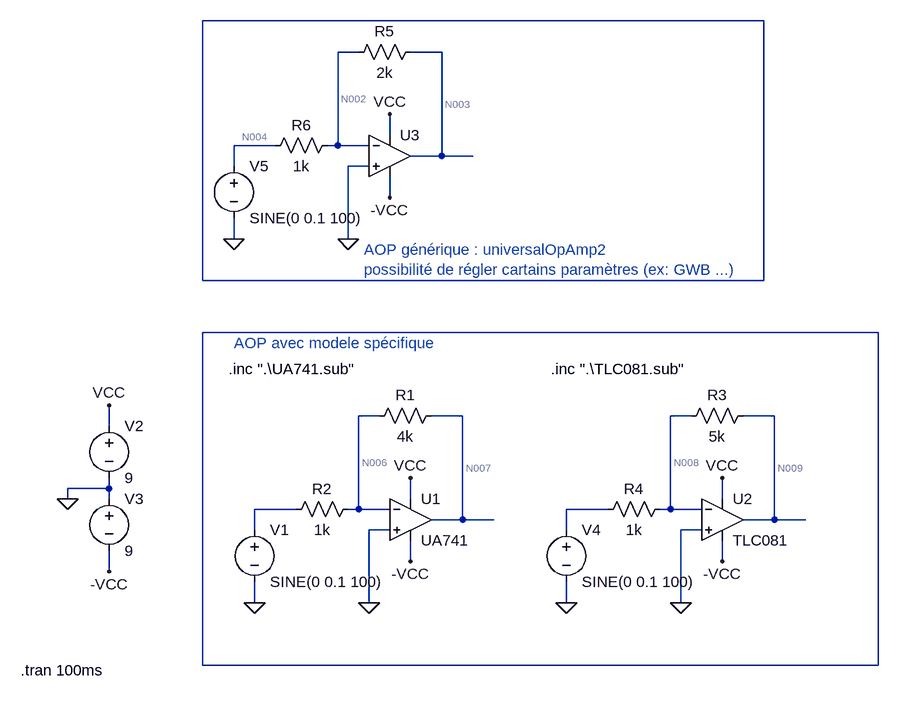
[diagram p0: schematic EssaiModeleAOP.asc]
EssaiModeleAOP.asc, the LTspice schematic file:
Version 4
SHEET 1 900 680
WIRE 720 -608 -144 -608
WIRE 96 -560 64 -560
WIRE 224 -560 176 -560
WIRE 144 -432 144 -464
WIRE -32 -416 -96 -416
WIRE 64 -416 64 -560
WIRE 64 -416 48 -416
WIRE 112 -416 64 -416
WIRE 224 -400 224 -560
WIRE 224 -400 176 -400
WIRE 272 -400 224 -400
WIRE -96 -384 -96 -416
WIRE 112 -384 80 -384
WIRE 144 -336 144 -368
WIRE -96 -272 -96 -304
WIRE 80 -272 80 -384
WIRE -144 -208 -144 -608
WIRE 720 -208 720 -608
WIRE 720 -208 -144 -208
WIRE 896 -128 -144 -128
WIRE 128 0 96 0
WIRE 256 0 208 0
WIRE 608 0 576 0
WIRE 736 0 688 0
WIRE -288 16 -288 -16
WIRE -288 112 -288 96
WIRE -288 112 -352 112
WIRE -352 128 -352 112
WIRE -288 128 -288 112
WIRE 176 128 176 96
WIRE 656 128 656 96
WIRE 0 144 -64 144
WIRE 96 144 96 0
WIRE 96 144 80 144
WIRE 144 144 96 144
WIRE 480 144 416 144
WIRE 576 144 576 0
WIRE 576 144 560 144
WIRE 624 144 576 144
WIRE 256 160 256 0
WIRE 256 160 208 160
WIRE 304 160 256 160
WIRE 736 160 736 0
WIRE 736 160 688 160
WIRE 784 160 736 160
WIRE -64 176 -64 144
WIRE 144 176 112 176
WIRE 416 176 416 144
WIRE 624 176 592 176
WIRE 176 224 176 192
WIRE 656 224 656 192
WIRE -288 240 -288 208
WIRE -64 288 -64 256
WIRE 112 288 112 176
WIRE 416 288 416 256
WIRE 592 288 592 176
WIRE -144 384 -144 -128
WIRE 896 384 896 -128
WIRE 896 384 -144 384
FLAG -64 288 0
FLAG -352 128 0
FLAG -288 -16 VCC
FLAG -288 240 -VCC
FLAG 176 96 VCC
FLAG 176 224 -VCC
FLAG 112 288 0
FLAG 416 288 0
FLAG 656 96 VCC
FLAG 656 224 -VCC
FLAG 592 288 0
FLAG -96 -272 0
FLAG 144 -464 VCC
FLAG 144 -336 -VCC
FLAG 80 -272 0
SYMBOL Opamps\\opamp2 176 96 R0
SYMATTR InstName U1
SYMATTR Value UA741
SYMBOL res 224 -16 R90
WINDOW 0 0 56 VBottom 2
WINDOW 3 32 56 VTop 2
SYMATTR InstName R1
SYMATTR Value 4k
SYMBOL res 96 128 R90
WINDOW 0 0 56 VBottom 2
WINDOW 3 32 56 VTop 2
SYMATTR InstName R2
SYMATTR Value 1k
SYMBOL voltage -64 160 R0
WINDOW 123 0 0 Left 2
WINDOW 39 0 0 Left 2
SYMATTR InstName V1
SYMATTR Value SINE(0 0.1 100)
SYMBOL voltage -288 0 R0
WINDOW 123 0 0 Left 2
WINDOW 39 0 0 Left 2
SYMATTR InstName V2
SYMATTR Value 9
SYMBOL voltage -288 112 R0
WINDOW 123 0 0 Left 2
WINDOW 39 0 0 Left 2
SYMATTR InstName V3
SYMATTR Value 9
SYMBOL Opamps\\opamp2 656 96 R0
SYMATTR InstName U2
SYMATTR Value TLC081
SYMBOL res 704 -16 R90
WINDOW 0 0 56 VBottom 2
WINDOW 3 32 56 VTop 2
SYMATTR InstName R3
SYMATTR Value 5k
SYMBOL res 576 128 R90
WINDOW 0 0 56 VBottom 2
WINDOW 3 32 56 VTop 2
SYMATTR InstName R4
SYMATTR Value 1k
SYMBOL voltage 416 160 R0
WINDOW 123 0 0 Left 2
WINDOW 39 0 0 Left 2
SYMATTR InstName V4
SYMATTR Value SINE(0 0.1 100)
SYMBOL res 192 -576 R90
WINDOW 0 0 56 VBottom 2
WINDOW 3 32 56 VTop 2
SYMATTR InstName R5
SYMATTR Value 2k
SYMBOL res 64 -432 R90
WINDOW 0 0 56 VBottom 2
WINDOW 3 32 56 VTop 2
SYMATTR InstName R6
SYMATTR Value 1k
SYMBOL voltage -96 -400 R0
WINDOW 123 0 0 Left 2
WINDOW 39 0 0 Left 2
SYMATTR InstName V5
SYMATTR Value SINE(0 0.1 100)
SYMBOL Opamps\\UniversalOpamp2 144 -400 R0
SYMATTR InstName U3
TEXT -424 392 Left 2 !.tran 100ms
TEXT 392 -72 Left 2 !.inc ".\\TLC081.sub"
TEXT -104 -72 Left 2 !.inc ".\\UA741.sub"
TEXT -96 -112 Left 2 ;AOP avec modele spécifique
TEXT 104 -256 Left 2 ;AOP générique : universalOpAmp2\npossibilité de régler cartains paramètres (ex: GWB ...)

The netlist it stands for:
* EssaiModeleAOP.asc
XU1 0 N006 VCC -VCC N007 UA741  ; pins In+ In- V+ V- OUT
R1 N007 N006 4k
R2 N006 N010 1k
V1 N010 0 SINE(0 0.1 100)
V2 VCC 0 9
V3 0 -VCC 9
XU2 0 N008 VCC -VCC N009 TLC081  ; pins In+ In- V+ V- OUT
R3 N009 N008 5k
R4 N008 N011 1k
V4 N011 0 SINE(0 0.1 100)
R5 N003 N002 2k
R6 N002 N004 1k
V5 N004 0 SINE(0 0.1 100)
XU3 0 N002 VCC -VCC N003 level.2 Avol=1Meg GBW=10Meg Slew=10Meg ilimit=25m rail=0 Vos=0 phimargin=45 en=0 enk=0 in=0 ink=0 Rin=500Meg  ; pins IN+ IN- V+ V- OUT
.tran 100ms
.inc ".\TLC081.sub"
.inc ".\UA741.sub"
* AOP avec modele spécifique
* AOP générique : universalOpAmp2
* possibilité de régler cartains paramètres (ex: GWB ...)
.lib UniversalOpamps2.sub
.backanno
.end

* Results of the author's LTspice run, read from the files saved beside the schematic
* Operating Point, zero values left out:
*   V(n007) = 375 µV
*   V(-vcc) = -9 V
*   V(vcc) = 9 V
*   V(n006) = 11.18 µV
*   V(n009) = 3.944 mV
*   V(n008) = 657.3 µV
*   I(R4) = 657.3 nA
*   I(R3) = 657.3 nA
*   I(R2) = 11.18 nA
*   I(R1) = 90.95 nA
*   I(V4) = 657.3 nA
*   I(V3) = -5.006 mA
*   I(V2) = -5.005 mA
*   I(V1) = 11.18 nA
*   Ix(u1:1) = 79.74 nA
*   Ix(u1:2) = 79.76 nA
*   Ix(u1:3) = 1.004 mA
*   Ix(u1:4) = -1.004 mA
*   Ix(u1:5) = -90.95 nA
*   Ix(u2:1) = 9.631 pA
*   Ix(u2:2) = 9.633 pA
*   Ix(u2:3) = 3.102 mA
*   Ix(u2:4) = -3.102 mA
*   Ix(u2:5) = -657.3 nA
*   Ix(u3:3) = 899.7 µA
*   Ix(u3:4) = -899.7 µA
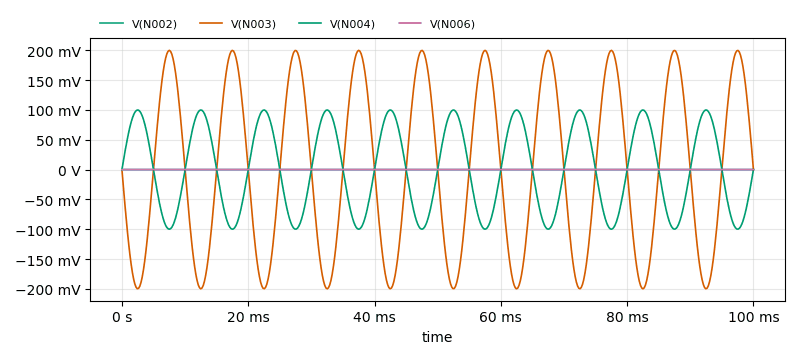
[diagram p1: Transient Analysis of EssaiModeleAOP.asc, plotted from the saved traces]
* Transient Analysis, 1 run:
*   V(N002): min -2.026 µV, max 2.719 µV, average 403.2 fV, rms 1.433 µV, last 2.017 µV
*   V(N003): min -199.8 mV, max 199.8 mV, average 250.4 nV, rms 141.3 mV, last 6.052 µV
*   V(N004): min -99.9 mV, max 99.9 mV, average -125.3 nV, rms 70.65 mV, last 0 V
*   V(N006): min -26.78 µV, max 49.42 µV, average 11.18 µV, rms 29.09 µV, last 49.12 µV